# Altium schematic sheet mcu.SchDoc
size A4
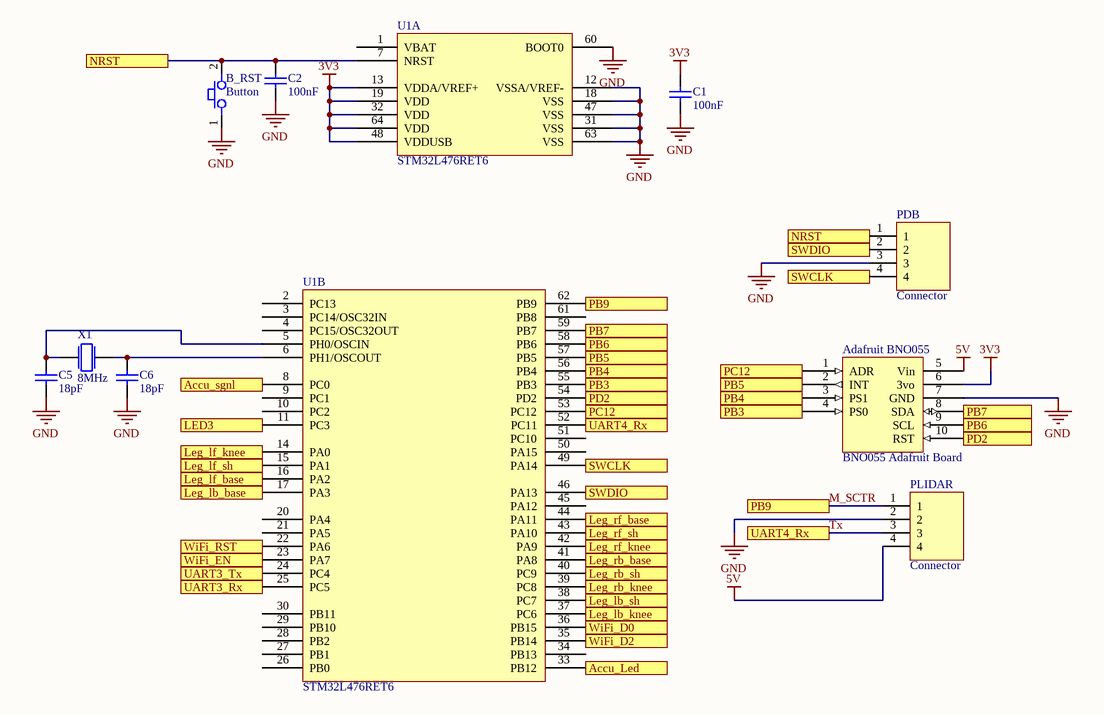
[diagram p0: mcu.SchDoc]

## Parts
Adafruit_BNO055  BNO055 Adafruit Board  [ADAFRUIT BNO055]
B_RST  Button  [Button]
C1  100nF  [FP_0805_CAP_085]
C2  100nF  [FP_0805_CAP_085]
C5  18pF  [FP_0805_CAP_085]
C6  18pF  [FP_0805_CAP_085]
PDB  Connector  [FP_CONN4_TAP_254MM_90]
PLIDAR  Connector  [FP_CONN4_LIDAR_2MM_90]
U1  STM32L476RET6  [STM32L476RET6]  (parts A,B of 2)
X1  8MHz  [OSC]

## Ports
Accu_Led, Accu_sgnl, LED3, Leg_lb_base, Leg_lb_knee, Leg_lb_sh, Leg_lf_base, Leg_lf_knee, Leg_lf_sh, Leg_rb_base, Leg_rb_knee, Leg_rb_sh, Leg_rf_base, Leg_rf_knee, Leg_rf_sh, NRST, PB3, PB4, PB5, PB6, PB7, PB9, PC12, PD2, SWCLK, SWDIO, UART3_Rx, UART3_Tx, UART4_Rx, WiFi_D0, WiFi_D2, WiFi_EN, WiFi_RST

## Nets
3V3: Adafruit_BNO055.6(3vo) C1.2 U1.13(VDDA/VREF+) U1.19(VDD) U1.32(VDD) U1.48(VDDUSB) U1.64(VDD)
5V: Adafruit_BNO055.5(Vin) PLIDAR.4
GND: Adafruit_BNO055.7(GND) B_RST.1 C1.1 C2.1 C5.1 C6.1 PDB.3 PLIDAR.2 U1.12(VSSA/VREF-) U1.18(VSS) U1.31(VSS) U1.47(VSS) U1.60(BOOT0) U1.63(VSS)
Accu_Led: U1.33(PB12) ; port Accu_Led
Accu_sgnl: U1.8(PC0) ; port Accu_sgnl
LED3: U1.11(PC3) ; port LED3
Leg_lb_base: U1.17(PA3) ; port Leg_lb_base
Leg_lb_knee: U1.37(PC6) ; port Leg_lb_knee
Leg_lb_sh: U1.38(PC7) ; port Leg_lb_sh
Leg_lf_base: U1.16(PA2) ; port Leg_lf_base
Leg_lf_knee: U1.14(PA0) ; port Leg_lf_knee
Leg_lf_sh: U1.15(PA1) ; port Leg_lf_sh
Leg_rb_base: U1.41(PA8) ; port Leg_rb_base
Leg_rb_knee: U1.39(PC8) ; port Leg_rb_knee
Leg_rb_sh: U1.40(PC9) ; port Leg_rb_sh
Leg_rf_base: U1.44(PA11) ; port Leg_rf_base
Leg_rf_knee: U1.42(PA9) ; port Leg_rf_knee
Leg_rf_sh: U1.43(PA10) ; port Leg_rf_sh
M_SCTR: PLIDAR.1 U1.62(PB9) ; port PB9
NRST: B_RST.2 C2.2 PDB.1 U1.7(NRST) ; port NRST
PB3: Adafruit_BNO055.4(PS0) U1.55(PB3) ; port PB3
PB4: Adafruit_BNO055.3(PS1) U1.56(PB4) ; port PB4
PB5: Adafruit_BNO055.2(INT) U1.57(PB5) ; port PB5
PB6: Adafruit_BNO055.9(SCL) U1.58(PB6) ; port PB6
PB7: Adafruit_BNO055.8(SDA) U1.59(PB7) ; port PB7
PC12: Adafruit_BNO055.1(ADR) U1.53(PC12) ; port PC12
PD2: Adafruit_BNO055.10(RST) U1.54(PD2) ; port PD2
SWCLK: PDB.4 U1.49(PA14) ; port SWCLK
SWDIO: PDB.2 U1.46(PA13) ; port SWDIO
Tx: PLIDAR.3 U1.52(PC11) ; port UART4_Rx
UART3_Rx: U1.25(PC5) ; port UART3_Rx
UART3_Tx: U1.24(PC4) ; port UART3_Tx
WiFi_D0: U1.36(PB15) ; port WiFi_D0
WiFi_D2: U1.35(PB14) ; port WiFi_D2
WiFi_EN: U1.23(PA7) ; port WiFi_EN
WiFi_RST: U1.22(PA6) ; port WiFi_RST
NetC5_2: C5.2 U1.5(PH0/OSCIN) X1.1
NetC6_2: C6.2 U1.6(PH1/OSCOUT) X1.2

Not connected (* = marked no-connect by the designer): U1 1(VBAT) 2(PC13) 3(PC14/OSC32IN) 4(PC15/OSC32OUT) 9(PC1) 10(PC2) 20(PA4) 21(PA5) 26(PB0) 27(PB1) 28(PB2) 29(PB10) 30(PB11) 34(PB13) 45(PA12) 50(PA15) 51(PC10) 61(PB8)

## Library data of the parts
Adafruit_BNO055 = BNO055 Adafruit Board: pin to pad: 1>ADR 2>INT 3>PS1 4>PS0 5>Vin 6>3vo 7>GND 8>SDA 9>SCL 10>RST; Reference: 485-2472; Name: Adafruit BNO055; Supplier: Mouser Electronics
B_RST = Button: Name: TACT 2.5x 3 2P SPST B3U-1000P (OMR) 2.5x3x1.2mm SMD H=1.2mm 153g; Reference: 45-09-96; Supplier: Lomex
C1 C2 = CAP 100nF: Capacitor; Tolerance: 10%; Voltage: 50V; Name: 100nF 0805 10% 50V X7R 0805B104K500CT (WAL); Supplier: Lomex; Reference: 82-10-76; Value: 100nF
C5 C6 = CAP: Capacitor; Tolerance: 5%; Voltage: 50V; Name: 18pF 0805 5% 50V NP0 CL21C180JBANNNC (SAM); Supplier: Lomex; Reference: 82-08-38; Value: 18pF
PDB = Connector_4pin: 4pin Connector; Name: TÁPCSATL. 2.54mm 4P APA 90° NCW254-04R (G-S) FORR.; Reference: 43-09-96; Supplier: Lomex
PLIDAR = Connector_4pin: 4pin Connector; Name: TÁPCSATL. 2.00mm 4P APA 90° B4B-PH-SM4-TB (LF)(SN) (JST) SMD Ł; Reference: 43-17-55; Supplier: Lomex
U1 = STM32L476RET6: Manufacturer: STMICROELECTRONICS; Reference: 2494459; Name: STM32L476RET6 -  ARM Microcontroller, Ultra Low Power, STM32 Family STM32L4 Series Microcontrollers, 32bit, 80 MHz; Manufacturer Part No: STM32L476RET6; Component Type: IC; Supplier: Farnell
X1 = Crystal: Quarz Crystal; Reference: 2508478; Name: QCS8.00000F18B23M -  Crystal, 8 MHz, SMD, 12.5mm x 4.6mm, 30 ppm, 18 pF, 20 ppm, QCS Series; Value: 8MHz; Supplier: Farnell